# EAGLE design CH9141_Bluetooth (EAGLE 7.7.0)
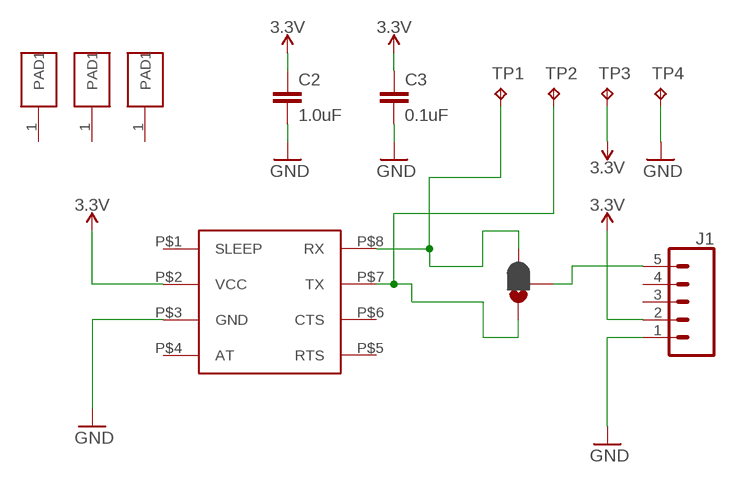
[diagram p0: schematic, sheet 1]

## Parts
C2  1.0uF  1.0UF-0805-25V-10%  [0805]
C3  0.1uF  CAP0805  [0805]
J1  CONN_051.27MM  [1X05_1.27MM]
JP1  JUMPER-SMT_3_1-NC_PASTE_NO-SILK  [SMT-JUMPER_3_1-NC_PASTE_NO-SILK]
TP1  TPB2,54  [B2,54]
TP2  TPB2,54  [B2,54]
TP3  TPB2,54  [B2,54]
TP4  TPB2,54  [B2,54]
U$1  CH9141  [CH9141_FOOTPRINT]
U$2  SINGLE_1.27MM_HOLE  [1.27MM_SINGLE_HOLE]
U$3  SINGLE_1.27MM_HOLE  [1.27MM_SINGLE_HOLE]
U$4  SINGLE_1.27MM_HOLE  [1.27MM_SINGLE_HOLE]

## Nets
3.3V: C2.1 C3.1 J1.2 TP3.TP U$1.P$2(VCC)
GND: C2.2 C3.2 J1.1 TP4.TP U$1.P$3(GND)
N$1: JP1.3 TP1.TP U$1.P$8(RX)
N$2: JP1.1 TP2.TP U$1.P$7(TX)
N$3: J1.5 JP1.2
Unconnected: J1.3 J1.4 U$1.P$1(SLEEP) U$1.P$4(AT) U$1.P$5(RTS) U$1.P$6(CTS) U$2.1(PAD1) U$3.1(PAD1) U$4.1(PAD1)

## Library data of the parts
C2 = SparkFun-Capacitors:1.0UF: 1µF ceramic capacitors A capacitor is a passive two-terminal electrical component used to store electrical energy temporarily in an electric field.; PROD_ID: CAP-08064
C3 = SparkFun_newer:CAP: Capacitor Standard 0603 ceramic capacitor, and 0.1" leaded capacitor.
J1 = MCXI_master_lib:CONN_05: Multi connection point. Often used as Generic Header-pin footprint for 0.1 inch spaced/style header connections On any of the 0.1 inch spaced packages, you can populate with these: Break Away Headers - Straight <https://www.sparkfun.com/products/116> (PRT-00116) Break Away Male Headers - Right Angle <https://www.sparkfun.com/products/553> (PRT-00553) Female Headers <https://www.sparkfun.com/products/115> (PRT-00115) Break Away Headers - Machine Pin <https://www.sparkfun.com/products/117> (PRT-00117) Break Away Female Headers - Swiss Machine Pin <https://www.sparkfun.com/products/743> (PRT-00743) For SCREWTERMINALS and SPRING TERMINALS visit here: Screw Terimnals on SparkFun.com <https://www.sparkfun.com/search/results?term=Screw+Terminals> (5mm/3.5mm/2.54mm spacing) This device is also useful as a general connection point to wire up your design to another part of your project. Our various solder wires solder well into these plated through hole pads. Hook-Up Wire - Assortment (Stranded, 22 AWG) <https://www.sparkfun.com/products/11375> (PRT-11375) Hook-Up Wire - Assortment (Solid Core, 22 AWG) <https://www.sparkfun.com/products/11367> (PRT-11367) View the entire wire category on our website here <https://www.sparkfun.com/categories/141> Special notes: Molex polarized connector foot print use with SKU : PRT-08231 with associated crimp pins and housings. 1MM SMD Version SKU: PRT-10208
JP1 = MCXI_master_lib:JUMPER-SMT_3_1-NC_PASTE: Normally closed solder jumper (1 of 2 connections) This jumper has an aperture in the stencil to allow solder paste to bridge one of the two connections. One connection is normally closed (NC), while the other is normally open (NO). Wick off the solder to open the connection. Reapply solder to reclose the connection. Apply solder to the other side instead to change the current path.
TP1-TP4 = MCXI_master_lib:TP: Test pad
U$1 = ch9141:CH9141
U$2-U$4 = MCXI_master_lib:SINGLE_1.27MM_HOLE

## Board
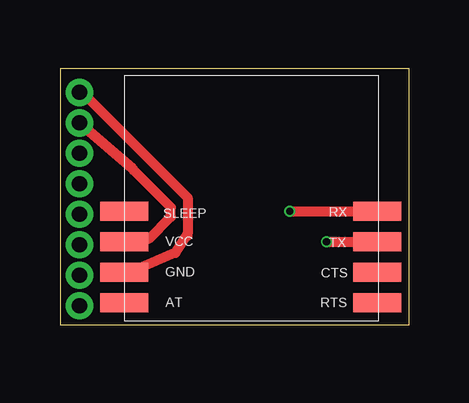
[diagram p1: board, top side]
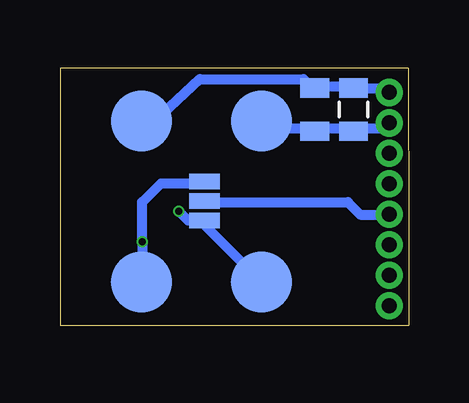
[diagram p2: board, bottom side, seen from below]

Size 14.53 x 10.7 mm. Coordinates in mm from the lower left corner, seen from the top.
Outline: 14.53,0 0,0 0,3.84 0.01,10.7 14.53,10.7 14.53,0
Copper layers (1*16): Top 0.035mm / dielectric 1.6mm / Bottom 0.035mm
Design rules "jlcpcb-2layers": minimum track width 5mil, minimum drill 0.3mm, track to track 5mil, track to pad 5mil, pad to pad 5mil, via to via 5mil, smd to smd 5mil, copper to edge 0.2mm, drill to drill 6mil, minimum pad ring 10mil, minimum via ring 3mil, stop-mask expansion 4mil, vias tented up to drill 0mil, thermal gap 10mil

### Footprints (pad centres in the part's own frame; a part is rotated, then mirrored left to right if it is on the bottom)
0805 = smd 0.8 x 1.2: 1 -0.9,0; 2 0.9,0
1X05_1.27MM = drill 0.63 pad 1: 1 0,0; 2 1.27,0; 3 2.54,0; 4 3.81,0; 5 5.08,0
SMT-JUMPER_3_1-NC_PASTE_NO-SILK = smd 0.635 x 1.27: 1 -0.813,0; 2 0,0; 3 0.813,0
B2,54 = smd 2.54 x 2.54: TP 0,0
CH9141_FOOTPRINT = smd 2 x 0.8: P$1 -5.4,-0.54; P$2 -5.4,-1.81; P$3 -5.4,-3.08; P$4 -5.4,-4.35; P$5 5.13,-4.35; P$6 5.13,-3.08; P$7 5.13,-1.81; P$8 5.13,-0.54
1.27MM_SINGLE_HOLE = drill 0.63 pad 0.8: 1 0,0

### Placement (x,y rotation side)
C2  3.92,8.98 90 bottom
C3  2.3,8.98 90 bottom
J1  0.81,9.7 270 top
JP1  8.51,5.17 270 bottom
TP1  6.14,1.8 0 bottom
TP2  11.14,1.8 0 bottom
TP3  6.14,8.51 0 bottom
TP4  11.14,8.51 0 bottom
U$1  8.08,5.29 0 top
U$2  0.81,0.81 0 top
U$3  0.81,2.08 0 top
U$4  0.81,3.35 0 top

### Tracks (layer width: path | path; a pad name or v marks a point on that pad's centre or on a via)
3.3V
  Top 0.127: 3.23,3.6 2.72,3.6 U$1.P$2 | J1.2
  Top 0.406: 3.23,3.6 3.71,3.6 4.62,4.51 4.62,4.91 3.12,6.41 3.03,6.51 J1.2
  Bottom 0.127: 2.34,8.18 C3.1 2.21,8.18 | 3.86,8.18 C2.1 3.99,8.18 | 1.07,8.18 J1.2 | 6.02,8.68 TP3.TP
  Bottom 0.406: 1.07,8.18 2.2,8.18 C3.1 | 2.34,8.18 3.82,8.18 C2.1 | 3.99,8.18 5.81,8.18 TP3.TP
GND
  Top 0.127: 3.23,2.33 2.72,2.33 U$1.P$3 | J1.1
  Top 0.406: J1.1 0.93,9.7 5.32,5.31 5.32,3.81 | 5.32,3.71 5.32,3.81 | 5.32,3.81 4.81,3.01 3.23,2.33
  Bottom 0.127: 2.34,9.95 C3.2 | 3.86,9.95 C2.2 3.99,9.95 4.25,10.21 | 11.1,8.51 TP4.TP
  Bottom 0.406: 11.1,8.51 10.24,8.81 8.7,10.25 4.39,10.25 C2.2 | 3.86,9.95 2.37,9.95 C3.2 0.99,9.88 J1.1
N$1  (via drill 0.3)
  Top 0.127: 13.13,4.75 U$1.P$8
  Top 0.406: v9.58,4.75 U$1.P$8
  Bottom 0.127: 8.44,4.24 JP1.3 8.56,4.37 8.94,4.37 | 6.02,1.83 TP1.TP
  Bottom 0.406: 8.44,4.24 8.44,4.1 TP1.TP | 8.94,4.37 9.2,4.37 v9.58,4.75
N$2  (via drill 0.3)
  Top 0.127: 13.13,3.48 U$1.P$7
  Top 0.406: v11.1,3.48 U$1.P$7
  Bottom 0.127: 9.07,5.89 8.56,5.89 JP1.1 | 11.1,1.83 TP2.TP
  Bottom 0.406: TP2.TP 11.02,1.92 11.02,2.51 11.12,2.61 11.32,2.61 11.1,2.83 v11.1,3.48 11.1,5.13 10.32,5.91 8.58,5.91 JP1.1
N$3
  Bottom 0.127: 8.44,5.13 JP1.2 | J1.5
  Bottom 0.406: 8.44,5.13 2.54,5.13 2.02,4.61 J1.5